# EAGLE schematic display 7 segmentos 4 digitos (EAGLE 8.5.1)
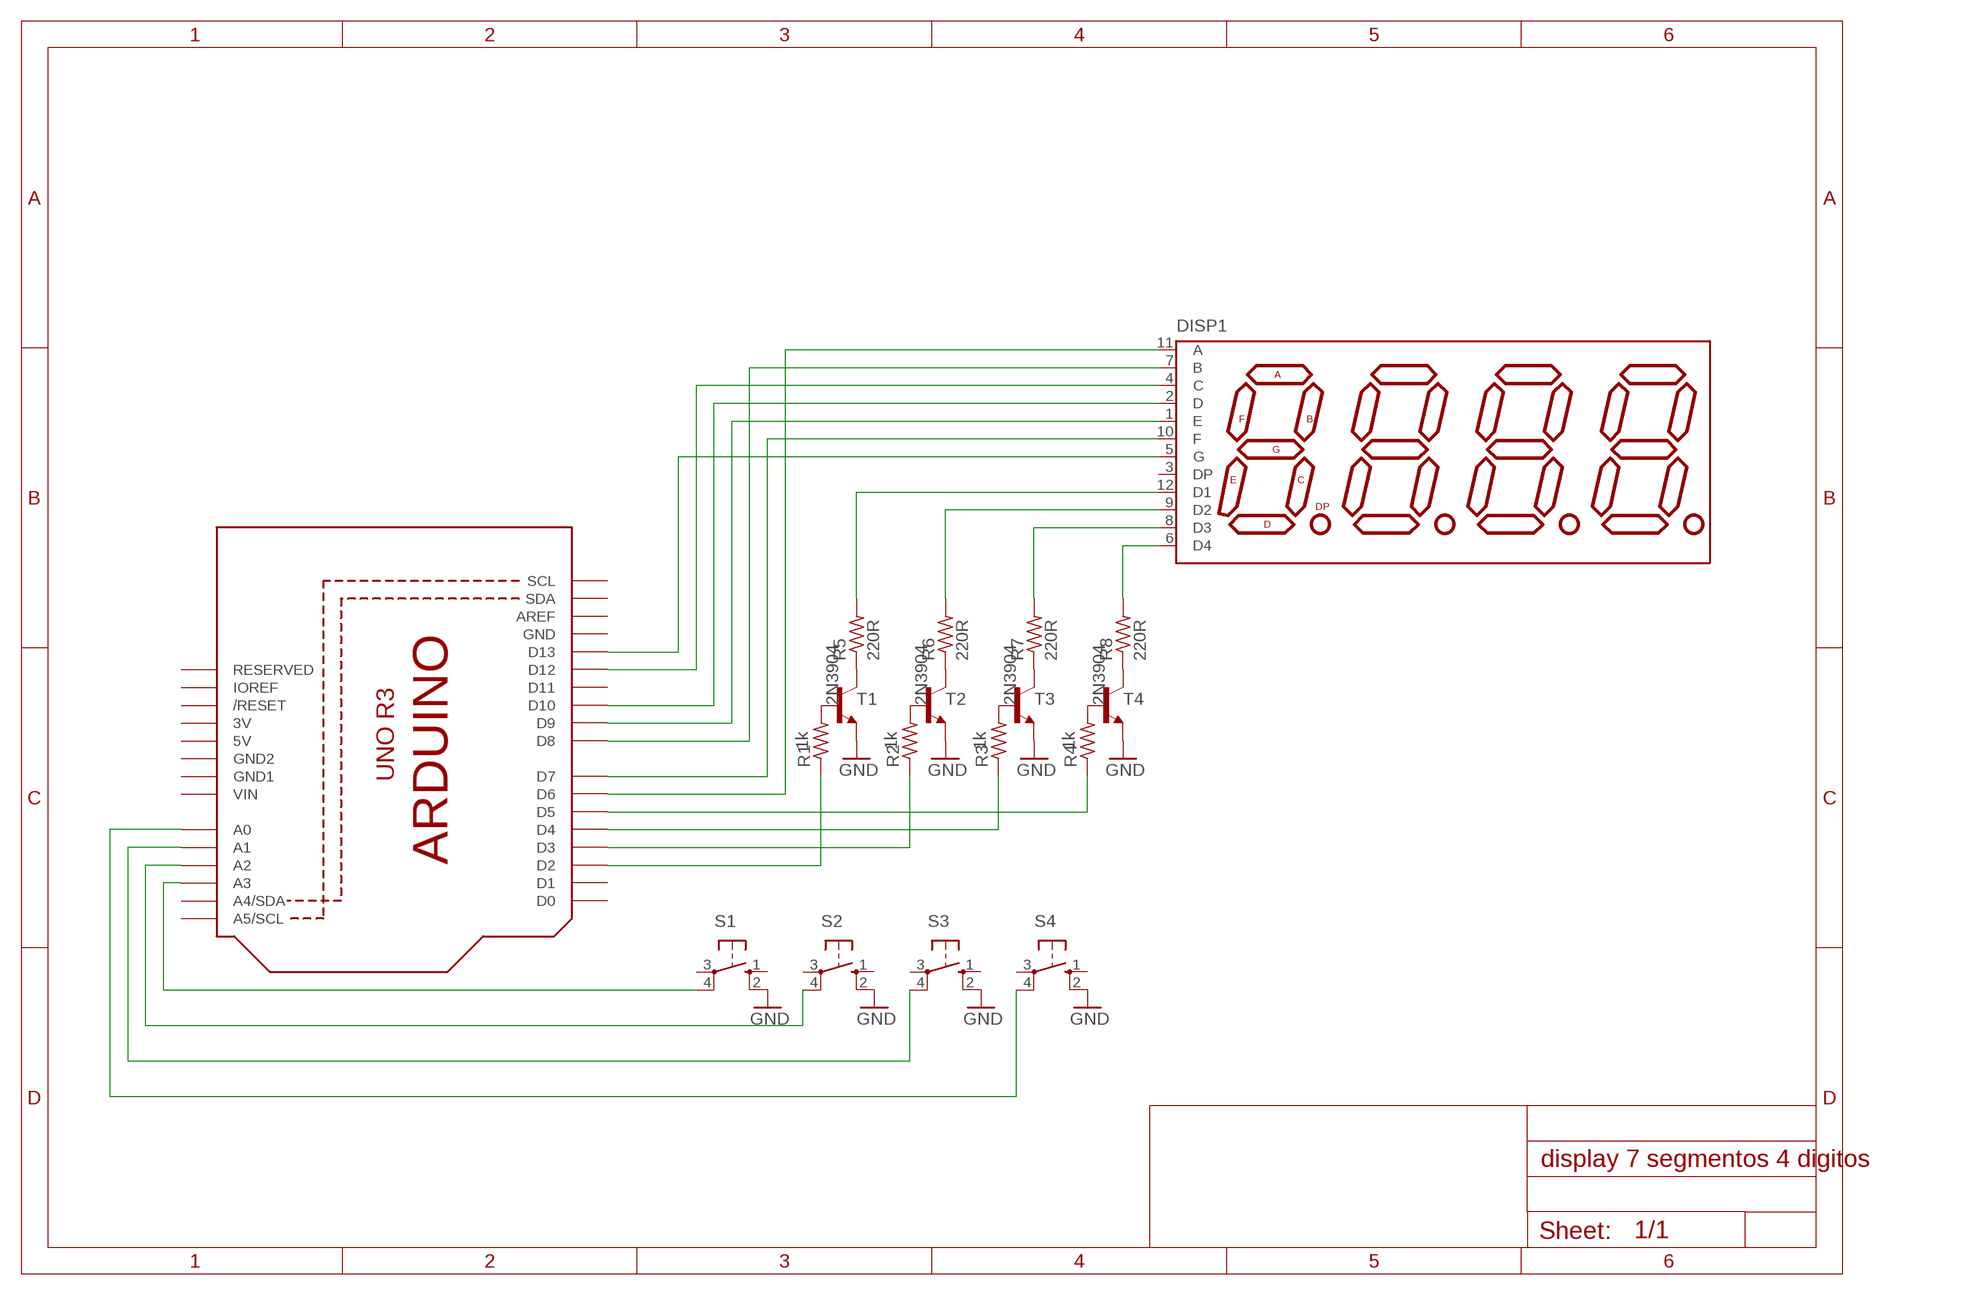
[diagram p0: schematic, sheet 1]

## Parts
DISP1  DISP_7SEG_4DIG  [DISP_7SEG_4DIG]
R1  1k  R-US_0207/10  [0207/10]
R2  1k  R-US_0207/10  [0207/10]
R3  1k  R-US_0207/10  [0207/10]
R4  1k  R-US_0207/10  [0207/10]
R5  220R  R-US_0207/10  [0207/10]
R6  220R  R-US_0207/10  [0207/10]
R7  220R  R-US_0207/10  [0207/10]
R8  220R  R-US_0207/10  [0207/10]
S1  10-XX  [B3F-10XX]
S2  10-XX  [B3F-10XX]
S3  10-XX  [B3F-10XX]
S4  10-XX  [B3F-10XX]
T1  2N3904  2N3904-NPN-TO92-EBC  [TO92-EBC]
T2  2N3904  2N3904-NPN-TO92-EBC  [TO92-EBC]
T3  2N3904  2N3904-NPN-TO92-EBC  [TO92-EBC]
T4  2N3904  2N3904-NPN-TO92-EBC  [TO92-EBC]
U1  ARDUINOR3-BPLACE  [ARDUINOR3-BPLACE]

## Nets
GND: S1.2(S1) S2.2(S1) S3.2(S1) S4.2(S1) T1.E T2.E T3.E T4.E
N$1: R1.2 T1.B
N$2: R2.2 T2.B
N$3: R3.2 T3.B
N$4: R4.2 T4.B
N$5: R5.1 T1.C
N$6: R6.1 T2.C
N$7: R7.1 T3.C
N$8: R8.1 T4.C
N$9: DISP1.6(D4) R8.2
N$10: DISP1.8(D3) R7.2
N$11: DISP1.9(D2) R6.2
N$12: DISP1.12(D1) R5.2
N$13: R1.1 U1.D2
N$14: R2.1 U1.D3
N$15: R3.1 U1.D4
N$16: R4.1 U1.D5
N$17: DISP1.11(A) U1.D6
N$18: DISP1.10(F) U1.D7
N$19: DISP1.7(B) U1.D8
N$20: DISP1.1(E) U1.D9
N$21: DISP1.2(D) U1.D10
N$22: DISP1.4(C) U1.D12
N$23: DISP1.5(G) U1.D13
N$24: S1.4(P1) U1.A3
N$25: S2.4(P1) U1.A2
N$26: S3.4(P1) U1.A1
N$27: S4.4(P1) U1.A0
Unconnected: DISP1.3(DP) S1.1(S) S1.3(P) S2.1(S) S2.3(P) S3.1(S) S3.3(P) S4.1(S) S4.3(P) U1.A4(A4/SDA) U1.A5(A5/SCL) U1.AREF U1.D0 U1.D1 U1.D11 U1.IOREF U1.RESERVED U1.RESET(/RESET) U1.SCL U1.SDA

## Power pins joined to a net without a drawn wire
3V: U1.3V
5V: U1.5V
GND: U1.GND
GND1: U1.GND1
GND2: U1.GND2
VIN: U1.VIN

## Library data of the parts
DISP1 = makerelectronico:DISP_7SEG_4DIG: Display 7 segment 4 digit code datasheet: FJ5461AH
R1-R8 = rcl:R-US_: RESISTOR, American symbol; SPICEPREFIX: R
S1-S4 = switch-omron:10-XX: OMRON SWITCH; MPN: B3F-1000; OC_FARNELL: 176432; OC_NEWARK: 36M3542
T1-T4 = transistor-neu-to92:*-NPN-: NPN Transistror
U1 = adafruit:ARDUINOR3: This is a new object for the new Arduino R3 - with extra pins that you may want to use (such as IOref, and duplicated A4/A5